# Altium schematic sheet MS_COM.SchDoc
size 571 x 281 mm
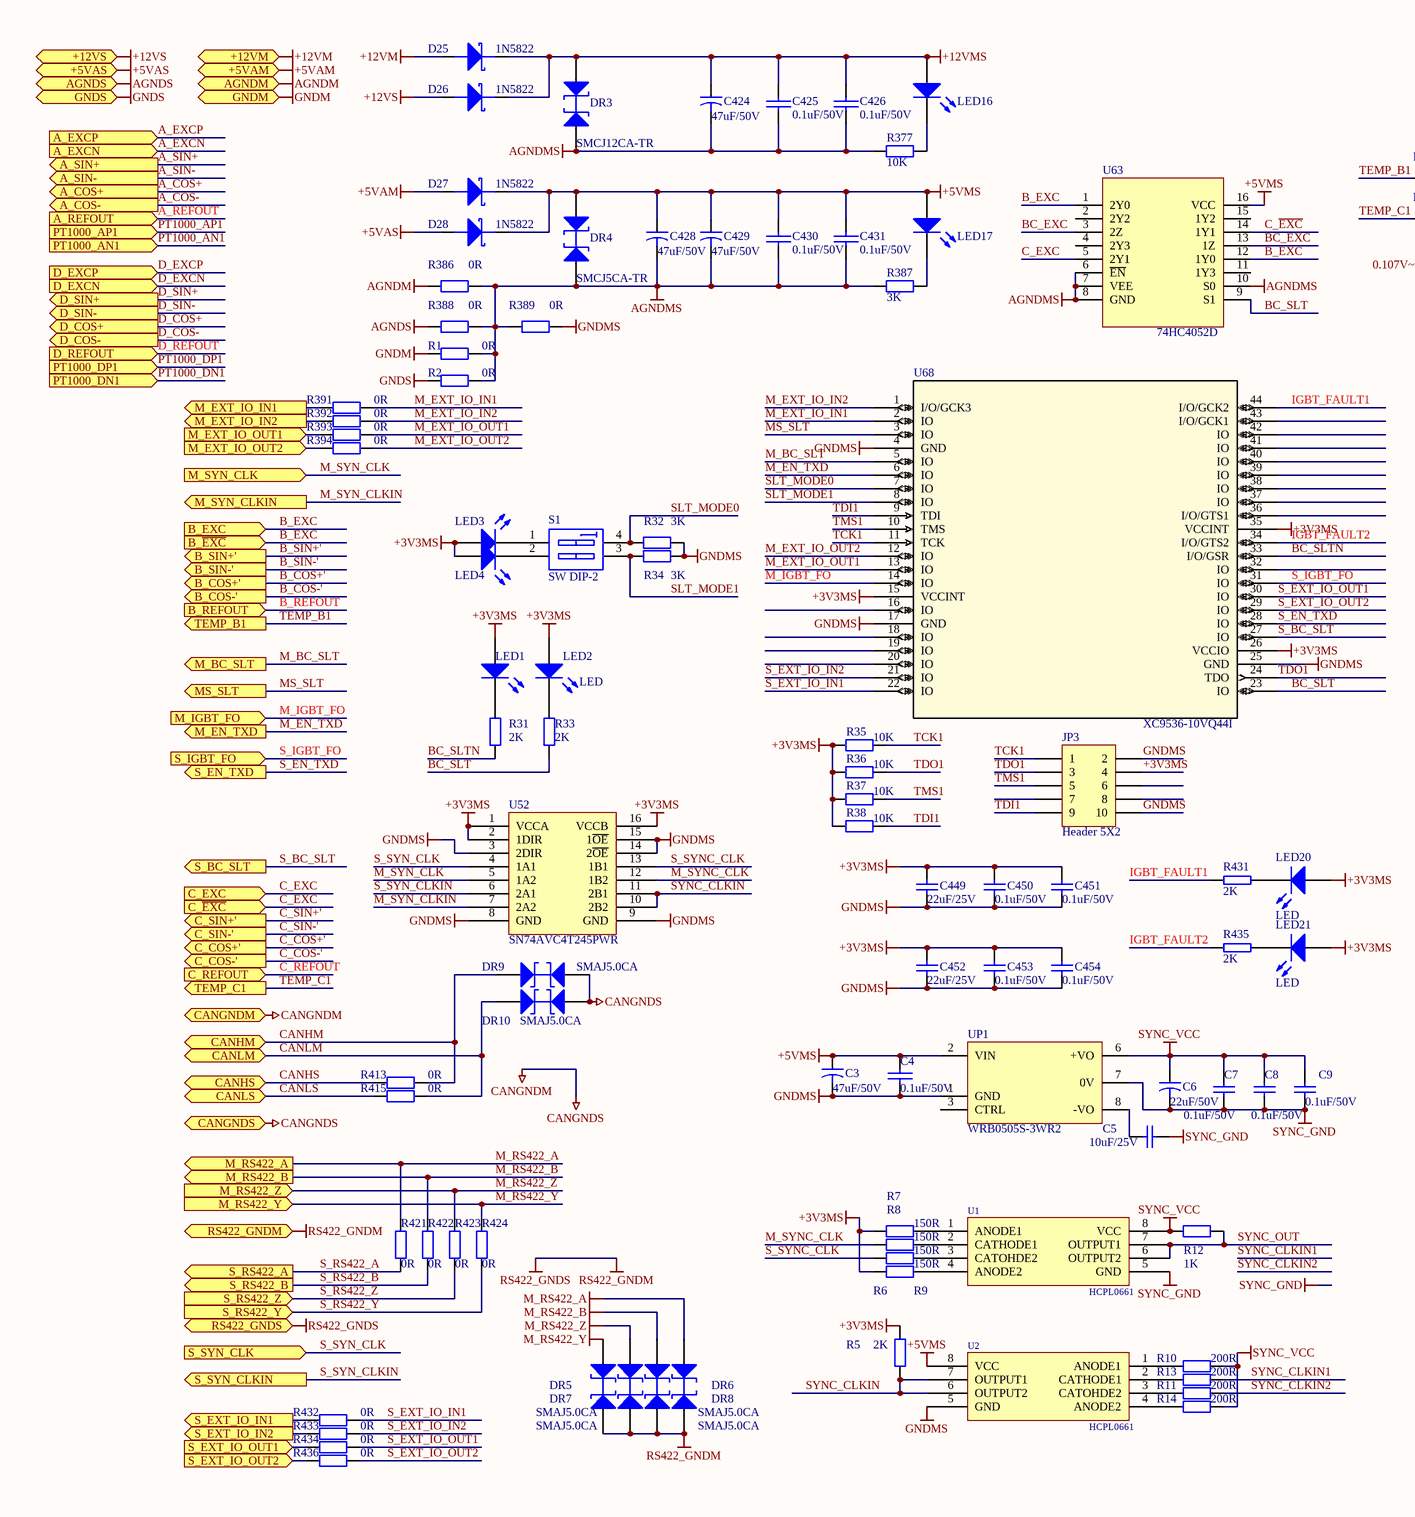
[diagram p0: MS_COM.SchDoc, left]
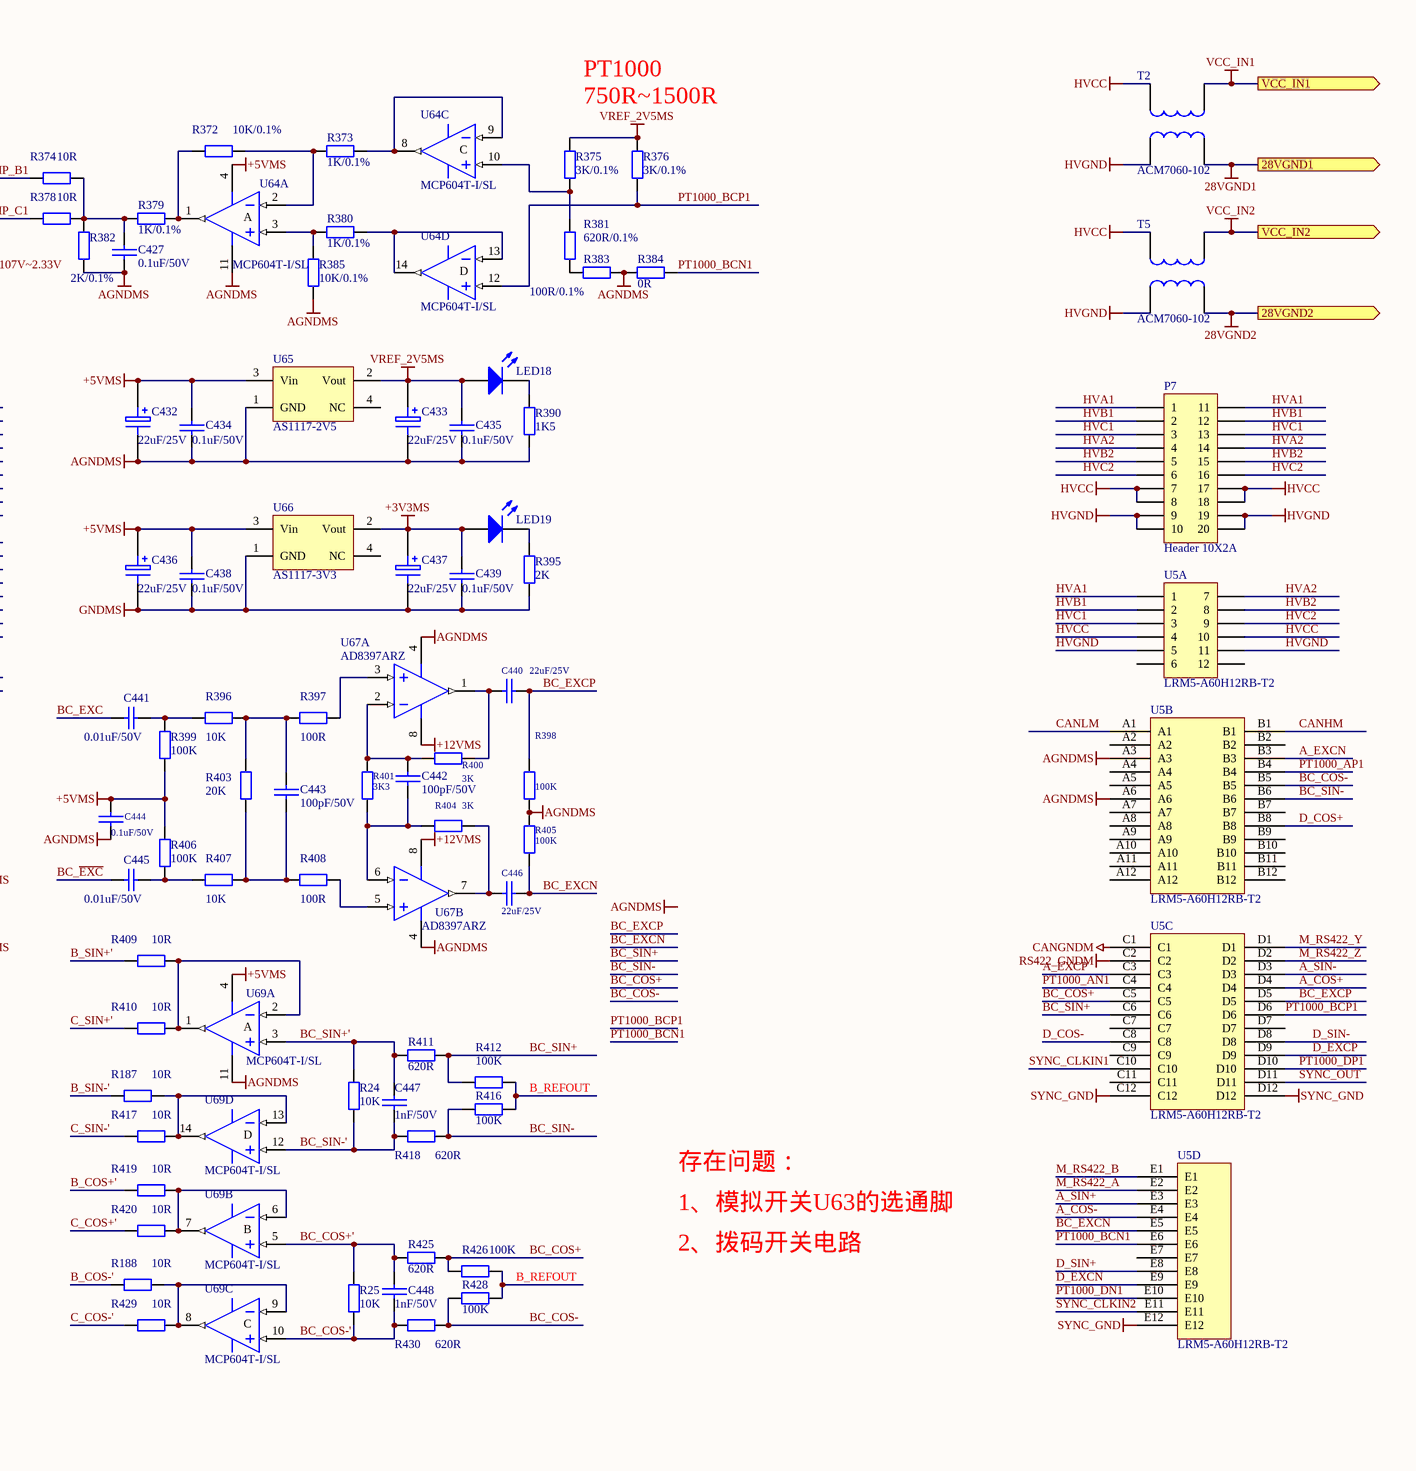
[diagram p1: MS_COM.SchDoc, right]

## Parts
C3  47uF/50V  [WP_1210CC]
C4  0.1uF/50V  [WP_0603C]
C5  10uF/25V  [WP_1206CC]
C6  22uF/50V  [WP_1206CC]
C7  0.1uF/50V  [WP_0603C]
C8  0.1uF/50V  [WP_0603C]
C9  0.1uF/50V  [WP_0603C]
C424  47uF/50V  [WP_1210CC]
C425  0.1uF/50V  [WP_0603C]
C426  0.1uF/50V  [WP_0603C]
C427  0.1uF/50V  [WP_0603C]
C428  47uF/50V  [WP_1210CC]
C429  47uF/50V  [WP_1210CC]
C430  0.1uF/50V  [WP_0603C]
C431  0.1uF/50V  [WP_0603C]
C432  22uF/25V  [WP_1206CC]
C433  22uF/25V  [WP_1206CC]
C434  0.1uF/50V  [WP_0603C]
C435  0.1uF/50V  [WP_0603C]
C436  22uF/25V  [WP_1206CC]
C437  22uF/25V  [WP_1206CC]
C438  0.1uF/50V  [WP_0603C]
C439  0.1uF/50V  [WP_0603C]
C440  22uF/25V  [WP_1206CC]
C441  0.01uF/50V  [WP_0603C]
C442  100pF/50V  [WP_0603C]
C443  100pF/50V  [WP_0603C]
C444  0.1uF/50V  [WP_0603C]
C445  0.01uF/50V  [WP_0603C]
C446  22uF/25V  [WP_1206CC]
C447  1nF/50V  [WP_0603C]
C448  1nF/50V  [WP_0603C]
C449  22uF/25V  [WP_1206CC]
C450  0.1uF/50V  [WP_0603C]
C451  0.1uF/50V  [WP_0603C]
C452  22uF/25V  [WP_1206CC]
C453  0.1uF/50V  [WP_0603C]
C454  0.1uF/50V  [WP_0603C]
D25  1N5822  [WP_SMA_DO214AC]
D26  1N5822  [WP_SMA_DO214AC]
D27  1N5822  [WP_SMA_DO214AC]
D28  1N5822  [WP_SMA_DO214AC]
DR3  SMCJ12CA-TR  [WP_SMA_DO214AC]
DR4  SMCJ5CA-TR  [WP_SMA_DO214AC]
DR5  SMAJ5.0CA  [WP_SMA_DO214AC]
DR6  SMAJ5.0CA  [WP_SMA_DO214AC]
DR7  SMAJ5.0CA  [WP_SMA_DO214AC]
DR8  SMAJ5.0CA  [WP_SMA_DO214AC]
DR9  SMAJ5.0CA  [WP_SMA_DO214AC]
DR10  SMAJ5.0CA  [WP_SMA_DO214AC]
JP3  Header 5X2  [HDR2X5]
LED1  LED  [WP_0603_LED]  (value not drawn)
LED2  LED  [WP_0603_LED]
LED3  LED  [WP_0603_LED]  (value not drawn)
LED4  LED  [WP_0603_LED]  (value not drawn)
LED16  LED  [WP_0603_LED]  (value not drawn)
LED17  LED  [WP_0603_LED]  (value not drawn)
LED18  LED  [WP_0603_LED]  (value not drawn)
LED19  LED  [WP_0603_LED]  (value not drawn)
LED20  LED  [WP_0603_LED]
LED21  LED  [WP_0603_LED]
P7  Header 10X2A  [WP_CRM222-020]
R1  0R  [WP_0603R]
R2  0R  [WP_0603R]
R5  2K  [WP_0603R]
R6  150R  [WP_0603R]
R7  150R  [WP_0603R]
R8  150R  [WP_0603R]
R9  150R  [WP_0603R]
R10  200R  [WP_0603R]
R11  200R  [WP_0603R]
R12  1K  [WP_0603R]
R13  200R  [WP_0603R]
R14  200R  [WP_0603R]
R24  10K  [WP_0603R]
R25  10K  [WP_0603R]
R31  2K  [WP_0603R]
R32  3K  [WP_0603R]
R33  2K  [WP_0603R]
R34  3K  [WP_0603R]
R35  10K  [WP_0603R]
R36  10K  [WP_0603R]
R37  10K  [WP_0603R]
R38  10K  [WP_0603R]
R187  10R  [WP_0603R]
R188  10R  [WP_0603R]
R372  10K/0.1%  [WP_0603R]
R373  1K/0.1%  [WP_0603R]
R374  10R  [WP_0603R]
R375  3K/0.1%  [WP_0603R]
R376  3K/0.1%  [WP_0603R]
R377  10K  [WP_0603R]
R378  10R  [WP_0603R]
R379  1K/0.1%  [WP_0603R]
R380  1K/0.1%  [WP_0603R]
R381  620R/0.1%  [WP_0603R]
R382  2K/0.1%  [WP_0603R]
R383  100R/0.1%  [WP_0603R]
R384  0R  [WP_0603R]
R385  10K/0.1%  [WP_0603R]
R386  0R  [WP_0603R]
R387  3K  [WP_0603R]
R388  0R  [WP_0603R]
R389  0R  [WP_0603R]
R390  1K5  [WP_0603R]
R391  0R  [WP_0603R]
R392  0R  [WP_0603R]
R393  0R  [WP_0603R]
R394  0R  [WP_0603R]
R395  2K  [WP_0603R]
R396  10K  [WP_0603R]
R397  100R  [WP_0603R]
R398  100K  [WP_0603R]
R399  100K  [WP_0603R]
R400  3K  [WP_0603R]
R401  3K3  [WP_0603R]
R403  20K  [WP_0603R]
R404  3K  [WP_0603R]
R405  100K  [WP_0603R]
R406  100K  [WP_0603R]
R407  10K  [WP_0603R]
R408  100R  [WP_0603R]
R409  10R  [WP_0603R]
R410  10R  [WP_0603R]
R411  620R  [WP_0603R]
R412  100K  [WP_0603R]
R413  0R  [WP_0603R]
R415  0R  [WP_0603R]
R416  100K  [WP_0603R]
R417  10R  [WP_0603R]
R418  620R  [WP_0603R]
R419  10R  [WP_0603R]
R420  10R  [WP_0603R]
R421  0R  [WP_0603R]
R422  0R  [WP_0603R]
R423  0R  [WP_0603R]
R424  0R  [WP_0603R]
R425  620R  [WP_0603R]
R426  100K  [WP_0603R]
R428  100K  [WP_0603R]
R429  10R  [WP_0603R]
R430  620R  [WP_0603R]
R431  2K  [WP_0603R]
R432  0R  [WP_0603R]
R433  0R  [WP_0603R]
R434  0R  [WP_0603R]
R435  2K  [WP_0603R]
R436  0R  [WP_0603R]
S1  SW DIP-2  [WP_DIP4]
T2  ACM7060-102  [WP_ACM7060]
T5  ACM7060-102  [WP_ACM7060]
U1  HCPL0661  [WP_SOIC8]
U2  HCPL0661  [WP_SOIC8]
U5  LRM5-A60H12RB-T2  [WP_LRM5-A60H12RB-T2]  (parts A,B,C,D of 4)
U52  SN74AVC4T245PWR  [WP_TSSOP16]
U63  74HC4052D  [WP_SOIC16]
U64  MCP604T-I/SL  [WP_SOIC14]  (parts A,C,D of 4)
U65  AS1117-2V5  [WP_SOT223]
U66  AS1117-3V3  [WP_SOT223]
U67  AD8397ARZ  [WP_SOIC8]  (parts A,B of 2)
U68  XC9536-10VQ44I  [WP_TQFP44]
U69  MCP604T-I/SL  [WP_SOIC14]  (parts A,B,C,D of 4)
UP1  WRB0505S-3WR2  [WP_WRB_CKS]

## Ports
28VGND1 (out), 28VGND2 (out), +5VAM (bidir), +5VAS (bidir), +12VM (bidir), +12VS (bidir), A_COS+ (out), A_COS- (out), A_EXCN (in), A_EXCP (in), A_REFOUT (in), A_SIN+ (out), A_SIN- (out), AGNDM (bidir), AGNDS (bidir), B_COS+' (out), B_COS-' (out), B_EXC (in), B_REFOUT (in), B_SIN+' (out), B_SIN-' (out), B_~{EXC} (in), C_COS+' (out), C_COS-' (out), C_EXC (in), C_REFOUT (in), C_SIN+' (out), C_SIN-' (out), C_~{EXC} (in), CANGNDM (bidir), CANGNDS (bidir), CANHM (bidir), CANHS (bidir), CANLM (bidir), CANLS (bidir), D_COS+ (out), D_COS- (out), D_EXCN (in), D_EXCP (in), D_REFOUT (in), D_SIN+ (out), D_SIN- (out), GNDM (bidir), GNDS (bidir), M_BC_SLT (out), M_EN_TXD (out), M_EXT_IO_IN1 (out), M_EXT_IO_IN2 (out), M_EXT_IO_OUT1 (in), M_EXT_IO_OUT2 (in), M_IGBT_FO (in), M_RS422_A (out), M_RS422_B (out), M_RS422_Y (in), M_RS422_Z (in), M_SYN_CLK (in), M_SYN_CLKIN (out), MS_SLT (out), PT1000_AN1 (in), PT1000_AP1 (in), PT1000_DN1 (in), PT1000_DP1 (in), RS422_GNDM (bidir), RS422_GNDS (bidir), S_BC_SLT (out), S_EN_TXD (out), S_EXT_IO_IN1 (out), S_EXT_IO_IN2 (out), S_EXT_IO_OUT1 (in), S_EXT_IO_OUT2 (in), S_IGBT_FO (in), S_RS422_A (out), S_RS422_B (out), S_RS422_Y (in), S_RS422_Z (in), S_SYN_CLK (in), S_SYN_CLKIN (out), TEMP_B1 (out), TEMP_C1 (out), VCC_IN1 (out), VCC_IN2 (out)

## Nets
28VGND1: T2.1 ; port 28VGND1
28VGND2: T5.1 ; port 28VGND2
+3V3MS: C437.1 C439.1 C449.2 C450.2 C451.2 C452.2 C453.2 C454.2 JP3.4 LED1.1(A) LED2.1(A) LED3.1(A) LED4.1(A) LED19.1(A) LED20.1(A) LED21.1(A) R5.2 R7.1 R9.1 R35.1 R36.1 R37.1 R38.1 U52.1(VCCA) U52.2(1DIR) U52.16(VCCB) U66.2(Vout) U68.15(VCCINT) U68.26(VCCIO) U68.35(VCCINT)
+5VAM: D27.1(A) ; port +5VAM
+5VAS: D28.1(A) ; port +5VAS
+5VMS: C3.1 C4.1 C428.1 C429.1 C430.1 C431.1 C432.1 C434.1 C436.1 C438.1 C444.1 D27.2(K) D28.2(K) DR4.1(A) LED17.1(A) R399.1 R406.2 U2.8(VCC) U63.16(VCC) U64.4 U65.3(Vin) U66.3(Vin) U69.4 UP1.2(VIN)
+12VM: D25.1(A) ; port +12VM
+12VMS: C424.1 C425.1 C426.1 D25.2(K) D26.2(K) DR3.1(A) LED16.1(A) U67.8(V+)
+12VS: D26.1(A) ; port +12VS
AGNDM: R386.1 ; port AGNDM
AGNDMS: C424.2 C425.2 C426.2 C427.2 C428.2 C429.2 C430.2 C431.2 C432.2 C433.2 C434.2 C435.2 C444.2 DR3.2(K) DR4.2(K) R1.2 R2.2 R377.2 R382.1 R383.1 R384.2 R385.2 R386.2 R387.2 R388.2 R389.1 R390.1 R398.1 R405.2 U5.A3 U5.A6 U63.6(~{EN}) U63.7(VEE) U63.8(GND) U63.10(S0) U64.11 U65.1(GND) U67.4(V-) U69.11
AGNDS: R388.1 ; port AGNDS
CANGNDM: DR9.1(A) DR10.1(A) U5.C1 ; port CANGNDM, port CANGNDS  [also labelled CANGNDS]
GNDM: R1.1 ; port GNDM
GNDMS: C3.2 C4.2 C436.2 C437.2 C438.2 C439.2 C449.1 C450.1 C451.1 C452.1 C453.1 C454.1 JP3.2 JP3.10 R32.2 R34.2 R389.2 R395.1 U2.5(GND) U52.3(2DIR) U52.8(GND) U52.9(GND) U52.14(2~{OE}) U52.15(1~{OE}) U66.1(GND) U68.4(GND) U68.17(GND) U68.25(GND) UP1.1(GND)
GNDS: R2.1 ; port GNDS
HVCC: P7.7 P7.8 P7.17 P7.18 T2.4 T5.4 U5.4 U5.10
HVGND: P7.9 P7.10 P7.19 P7.20 T2.2 T5.2 U5.5 U5.11
M_RS422_A: DR6.2(K) R421.1 U5.E2 ; port M_RS422_A
M_RS422_B: DR8.2(K) R422.1 U5.E1 ; port M_RS422_B
M_RS422_Y: DR5.2(K) R424.1 U5.D1 ; port M_RS422_Y
M_RS422_Z: DR7.2(K) R423.1 U5.D2 ; port M_RS422_Z
RS422_GNDM: DR5.1(A) DR6.1(A) DR7.1(A) DR8.1(A) U5.C2 ; port RS422_GNDM, port RS422_GNDS  [also labelled RS422_GNDS]
SYNC_GND: C5.1 C6.2 C7.1 C8.1 C9.1 U1.5(GND) U5.C12 U5.D12 U5.E12 UP1.7(0V)
SYNC_VCC: C6.1 C7.2 C8.2 C9.2 R10.1 R12.1 R14.1 U1.8(VCC) UP1.6(+VO)
VCC_IN1: T2.3 ; port VCC_IN1
VCC_IN2: T5.3 ; port VCC_IN2
VREF_2V5MS: C433.1 C435.1 LED18.1(A) R375.1 R376.1 U65.2(Vout)
A_COS+: U5.D4 ; port A_COS+
A_COS-: U5.E4 ; port A_COS-
A_EXCN: U5.B3 ; port A_EXCN
A_EXCP: U5.C3 ; port A_EXCP
A_REFOUT: port A_REFOUT
A_SIN+: U5.E3 ; port A_SIN+
A_SIN-: U5.D3 ; port A_SIN-
B_COS+': R419.2 ; port B_COS+'
B_COS-': R188.2 ; port B_COS-'
B_~{EXC}: U63.12(1Y0) ; port B_~{EXC}
B_EXC: U63.1(2Y0) ; port B_EXC
B_REFOUT: R412.1 R416.1 R426.1 R428.1 ; port B_REFOUT
B_SIN+': R409.2 ; port B_SIN+'
B_SIN-': R187.2 ; port B_SIN-'
BC_COS+: R425.1 R426.2 U5.C5
BC_COS+': C448.2 R25.1 R425.2 U69.5(IN+)
BC_COS-: R428.2 R430.1 U5.B5
BC_COS-': C448.1 R25.2 R430.2 U69.10(IN+)
BC_~{EXC}: C445.2 U63.13(1Z)
BC_EXC: C441.2 U63.3(2Z)
BC_EXCN: C446.1 R405.1 U5.E5
BC_EXCP: C440.1 R398.2 U5.D5
BC_SIN+: R411.1 R412.2 U5.C6
BC_SIN+': C447.2 R24.1 R411.2 U69.3(IN+)
BC_SIN-: R416.2 R418.1 U5.B6
BC_SIN-': C447.1 R24.2 R418.2 U69.12(IN+)
BC_SLT: R33.2 U63.9(S1) U68.23(IO)
BC_SLTN: R31.2 U68.33(I/O/GSR)
C_COS+': R420.2 ; port C_COS+'
C_COS-': R429.2 ; port C_COS-'
C_~{EXC}: U63.14(1Y1) ; port C_~{EXC}
C_EXC: U63.5(2Y1) ; port C_EXC
C_REFOUT: port C_REFOUT
C_SIN+': R410.2 ; port C_SIN+'
C_SIN-': R417.2 ; port C_SIN-'
CANHM: DR9.2(K) R413.2 U5.B1 ; port CANHM
CANHS: R413.1 ; port CANHS
CANLM: DR10.2(K) R415.2 U5.A1 ; port CANLM
CANLS: R415.1 ; port CANLS
D_COS+: U5.B8 ; port D_COS+
D_COS-: U5.C8 ; port D_COS-
D_EXCN: U5.E9 ; port D_EXCN
D_EXCP: U5.D9 ; port D_EXCP
D_REFOUT: port D_REFOUT
D_SIN+: U5.E8 ; port D_SIN+
D_SIN-: U5.D8 ; port D_SIN-
HVA1: P7.1 P7.11 U5.1
HVA2: P7.4 P7.14 U5.7
HVB1: P7.2 P7.12 U5.2
HVB2: P7.5 P7.15 U5.8
HVC1: P7.3 P7.13 U5.3
HVC2: P7.6 P7.16 U5.9
IGBT_FAULT1: R431.1 U68.44(I/O/GCK2)
IGBT_FAULT2: R435.1 U68.34(I/O/GTS2)
M_BC_SLT: U68.5(IO) ; port M_BC_SLT
M_EN_TXD: U68.6(IO) ; port M_EN_TXD
M_EXT_IO_IN1: R391.2 U68.2(IO)
M_EXT_IO_IN1: R391.1 ; port M_EXT_IO_IN1  [a separate net that carries the same name]
M_EXT_IO_IN2: R392.2 U68.1(I/O/GCK3)
M_EXT_IO_IN2: R392.1 ; port M_EXT_IO_IN2  [a separate net that carries the same name]
M_EXT_IO_OUT1: R393.2 U68.13(IO)
M_EXT_IO_OUT1: R393.1 ; port M_EXT_IO_OUT1  [a separate net that carries the same name]
M_EXT_IO_OUT2: R394.2 U68.12(IO)
M_EXT_IO_OUT2: R394.1 ; port M_EXT_IO_OUT2  [a separate net that carries the same name]
M_IGBT_FO: U68.14(IO) ; port M_IGBT_FO
M_SYN_CLK: U52.5(1A2) ; port M_SYN_CLK
M_SYN_CLKIN: U52.7(2A2) ; port M_SYN_CLKIN
M_SYNC_CLK: R8.1 U52.12(1B2)
MS_SLT: U68.3(IO) ; port MS_SLT
PT1000_AN1: U5.C4 ; port PT1000_AN1
PT1000_AP1: U5.B4 ; port PT1000_AP1
PT1000_BCN1: R384.1 U5.E6
PT1000_BCP1: R376.2 U5.D6 U64.12(IN+)
PT1000_DN1: U5.E10 ; port PT1000_DN1
PT1000_DP1: U5.D10 ; port PT1000_DP1
S_BC_SLT: U68.27(IO) ; port S_BC_SLT
S_EN_TXD: U68.28(IO) ; port S_EN_TXD
S_EXT_IO_IN1: R432.2 U68.22(IO)
S_EXT_IO_IN1: R432.1 ; port S_EXT_IO_IN1  [a separate net that carries the same name]
S_EXT_IO_IN2: R433.2 U68.21(IO)
S_EXT_IO_IN2: R433.1 ; port S_EXT_IO_IN2  [a separate net that carries the same name]
S_EXT_IO_OUT1: R434.2 U68.30(IO)
S_EXT_IO_OUT1: R434.1 ; port S_EXT_IO_OUT1  [a separate net that carries the same name]
S_EXT_IO_OUT2: R436.2 U68.29(IO)
S_EXT_IO_OUT2: R436.1 ; port S_EXT_IO_OUT2  [a separate net that carries the same name]
S_IGBT_FO: U68.31(IO) ; port S_IGBT_FO
S_RS422_A: R421.2 ; port S_RS422_A
S_RS422_B: R422.2 ; port S_RS422_B
S_RS422_Y: R424.2 ; port S_RS422_Y
S_RS422_Z: R423.2 ; port S_RS422_Z
S_SYN_CLK: U52.4(1A1) ; port S_SYN_CLK
S_SYN_CLKIN: U52.6(2A1) ; port S_SYN_CLKIN
S_SYNC_CLK: R6.1 U52.13(1B1)
SLT_MODE0: R32.1 S1.4(B1) U68.7(IO)
SLT_MODE1: R34.1 S1.3(B2) U68.8(IO)
SYNC_CLKIN: R5.1 U2.6(OUTPUT2) U2.7(OUTPUT1) U52.10(2B2) U52.11(2B1)
SYNC_CLKIN1: R13.1 U5.C10
SYNC_CLKIN2: R11.1 U5.E11
SYNC_OUT: R12.2 U1.6(OUTPUT2) U1.7(OUTPUT1) U5.D11
TCK1: JP3.1 R35.2 U68.11(TCK)
TDI1: JP3.9 R38.2 U68.9(TDI)
TDO1: JP3.3 R36.2 U68.24(TDO)
TEMP_B1: R374.2 ; port TEMP_B1
TEMP_C1: R378.2 ; port TEMP_C1
TMS1: JP3.5 R37.2 U68.10(TMS)
NetC5_2: C5.2 UP1.8(-VO)
NetC427_1: C427.1 R374.1 R378.1 R379.2 R382.2
NetC440_2: C440.2 R400.2 U67.1(OUT1)
NetC441_1: C441.1 R396.1 R399.2
NetC442_1: C442.1 R400.1 R401.2 U67.2(IN1-)
NetC442_2: C442.2 R401.1 R404.1 U67.6(IN2-)
NetC443_1: C443.1 R403.1 R407.2 R408.1
NetC443_2: C443.2 R396.2 R397.1 R403.2
NetC445_1: C445.1 R406.1 R407.1
NetC446_2: C446.2 R404.2 U67.7(OUT2)
NetLED1_2: LED1.2(K) R31.1
NetLED2_2: LED2.2(K) R33.1
NetLED3_2: LED3.2(K) S1.1(A1)
NetLED4_2: LED4.2(K) S1.2(A2)
NetLED16_2: LED16.2(K) R377.1
NetLED17_2: LED17.2(K) R387.1
NetLED18_2: LED18.2(K) R390.2
NetLED19_2: LED19.2(K) R395.2
NetLED20_2: LED20.2(K) R431.2
NetLED21_2: LED21.2(K) R435.2
NetR6_2: R6.2 U1.3(CATOHDE2)
NetR7_2: R7.2 U1.1(ANODE1)
NetR8_2: R8.2 U1.2(CATHODE1)
NetR9_2: R9.2 U1.4(ANODE2)
NetR10_2: R10.2 U2.1(ANODE1)
NetR11_2: R11.2 U2.3(CATOHDE2)
NetR13_2: R13.2 U2.2(CATHODE1)
NetR14_2: R14.2 U2.4(ANODE2)
NetR187_1: R187.1 R417.1 U69.13(IN-) U69.14(OUT)
NetR188_1: R188.1 R429.1 U69.8(OUT) U69.9(IN-)
NetR372_1: R372.1 R379.1 U64.1(OUT)
NetR372_2: R372.2 R373.1 U64.2(IN-)
NetR373_2: R373.2 U64.8(OUT) U64.9(IN-)
NetR375_2: R375.2 R381.1 U64.10(IN+)
NetR380_1: R380.1 R385.1 U64.3(IN+)
NetR380_2: R380.2 U64.13(IN-) U64.14(OUT)
NetR381_2: R381.2 R383.2
NetR397_2: R397.2 U67.3(IN1+)
NetR408_2: R408.2 U67.5(IN2+)
NetR409_1: R409.1 R410.1 U69.1(OUT) U69.2(IN-)
NetR419_1: R419.1 R420.1 U69.6(IN-) U69.7(OUT)

Not connected (* = marked no-connect by the designer): JP3 6 7 8; U5 6 12 A2 A4 A5 A7 A8 A9 A10 A11 A12 B2 B7 B9 B10 B11 B12 C7 C9 C11 D7 E7; U63 2(2Y2) 4(2Y3) 11(1Y3) 15(1Y2); U65 4(NC); U66 4(NC); U68 16(IO) 18(IO) 19(IO) 20(IO) 32(IO) 36(I/O/GTS1) 37(IO) 38(IO) 39(IO) 40(IO) 41(IO) 42(IO) 43(I/O/GCK1); UP1 3(CTRL)

## Notes on the sheet
- Labels drawn without touching a wire or pin: 0.107V~2.33V, 1、模拟开关U63的选通脚, 2、拨码开关电路, 750R~1500R, AGNDMS, PT1000, 存在问题：
- (in symbol TL084D, part A) A
- (in symbol TL084D, part B) B
- (in symbol TL084D, part C) C
- (in symbol TL084D, part D) D

## Library data of the parts
C3 C6 C424 C428 C429 = Cap2: Capacitor; Published: 23-Sep-2002; Publisher: Altium Limited
C4 C425-C427 C430 C431 C434 C435 C438-C440 C442 C443 C446-C448 = CAP: Capacitor
C5 C7-C9 C441 C445 C449-C454 = Cap Semi: Capacitor (Semiconductor SIM Model); Published: 8-Jun-2000; Revision: July-2002: Re-released for DXP Platform.; Publisher: Altium Limited
C432 C433 C436 C437 = ELECTRO1: Electrolytic Capacitor
C444 = CAP
D25-D28 = DIODE SCHOTTKY: Schottky Diode
DR3 DR4 = TVS
DR5-DR10 = TVS: Resistor
JP3 = Header 5X2: Header, 5-Pin, Dual row; LatestRevisionDate: 17-Jul-2002; LatestRevisionNote: Re-released for DXP Platform.; Publisher: Altium Limited
LED1-LED4 LED16-LED21 = LED2: Published: 8-Jun-2000; LatestRevisionDate: 17-Jul-2002; LatestRevisionNote: Re-released for DXP Platform.; PackageDocument: Feb-2002; PackageReference: 3.2X1.6X1.1; Publisher: Altium Limited
P7 = Header 10X2A: Header, 10-Pin, Dual row; LatestRevisionDate: 17-Jul-2002; LatestRevisionNote: Re-released for DXP Platform.; Publisher: Altium Limited
R1 R2 R5-R14 R24 R25 R31-R34 R187 R188 R372-R401 R403-R413 R415-R426 R428-R430 R432-R434 R436 = Res2: Resistor; Published: 8-Jun-2000; Revision: July-2002: Re-released for DXP Platform.; Publisher: Altium Limited
R35-R38 = Res2: Resistor; Value: 4.7K; Published: 8-Jun-2000; Revision: July-2002: Re-released for DXP Platform.; Publisher: Altium Limited
R431 R435 = WP_RES
S1 = SW DIP-2: DIP Switch, 2 Position, SPST; Published: 24-Mar-1999; LatestRevisionDate: 17-Jul-2002; LatestRevisionNote: Re-released for DXP Platform.; PackageReference: DIP-4; Publisher: Altium Limited
T2 T5 = Trans: Transformer; Published: 24-Mar-1999; LatestRevisionDate: 08-Jul-2005; LatestRevisionNote: Mech Layer 1 removed.; PackageReference: TRANS; Publisher: Altium Limited; PackageDescription: Transformer; 4 Leads
U1 U2 = HCPL2531
U5 = MULTI_HEADER
U52 = 74AVC4T245
U63 = 74HC4052
U64 U69 = TL084D: JFET-Input Operational Amplifier; Package Information: Latest Revision: Jan-1998; Published: 16-Jan-2001; Revision: 17-Jul-2002: Re-released for DXP Platform.; Datasheet: Latest Revision: Feb-1999; Package Reference: D014; Publisher: Altium Limited
U65 U66 = AS1117
U67 = LT1358: Fast Settling Dual Operational Amplifier
U68 = XC9536-10VQ44I: No Description Available; Mfr_Name: Xilinx Inc; Copyright: Copyright (C) 2022 Ultra Librarian. All rights reserved.; Manufacturer_Part_Number: XC9536-10VQ44I; RefDes: RefDes; Type: DEV
UP1 = WRB1212S-3WR2